# Altium schematic sheet Power.SchDoc
size A3
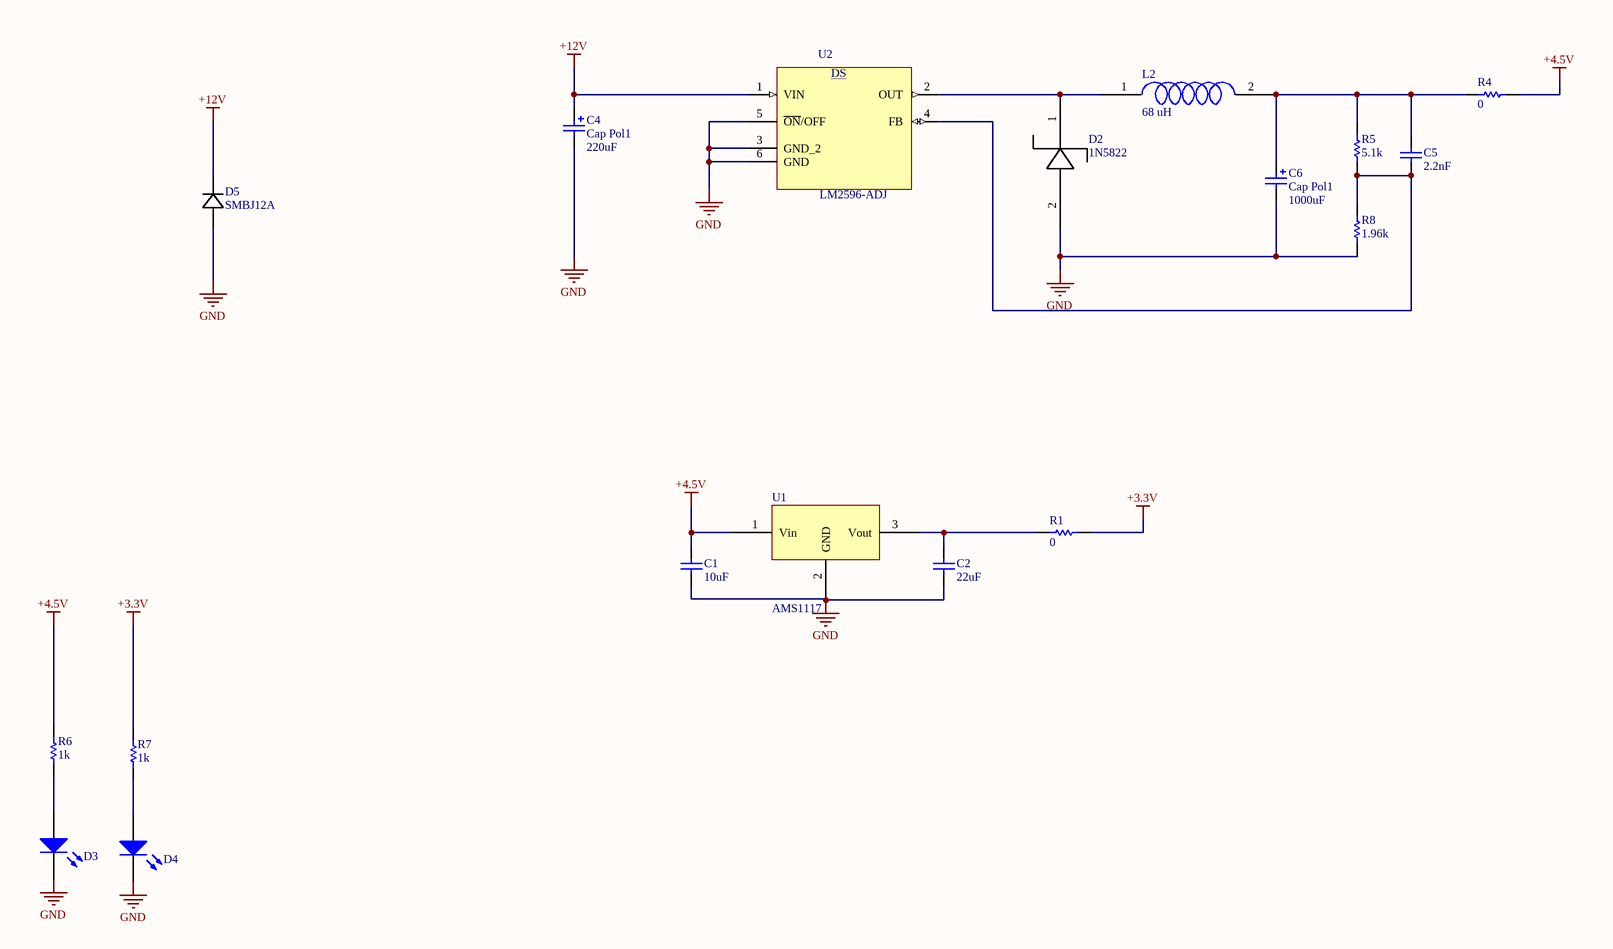
[diagram p0: Power.SchDoc]

## Parts
C1  value 10uF  [C-1206]  (hidden comment: C-1206)
C2  value 22uF  [C-1206]  (hidden comment: C-1206)
C4  Cap Pol1  value 220uF  [RB5-10.5]
C5  value 2.2nF  [C-805]  (hidden comment: C-805)
C6  Cap Pol1  value 1000uF  [RB5-10.5]
D2  1N5822  [1N5822]
D3  LED-805  [LED-805]  (value not drawn)
D4  LED-805  [LED-805]  (value not drawn)
D5  SMBJ12A  [SMB]
L2  68 uH  [Inductor]
R1  value 0  [R-1206]  (hidden comment: R-1206)
R4  value 0  [R-1206]  (hidden comment: R-1206)
R5  value 5.1k  [R-805]  (hidden comment: R-805)
R6  value 1k  [R-805]  (hidden comment: R-805)
R7  value 1k  [R-805]  (hidden comment: R-805)
R8  value 1.96k  [R-805]  (hidden comment: R-805)
U1  AMS1117  [AMS1117]
U2  LM2596-ADJ  [LM2596SX]

## Nets
+3.3V: R1.2 R7.2
+4.5V: C1.2 R4.2 R6.2 U1.1(Vin)
+12V: C4.1 D5.1 U2.1(VIN)
GND: C1.1 C2.1 C4.2 C6.2 D2.2 D3.2(K) D4.2(K) D5.2 R8.2 U1.2(GND) U2.3(GND_2) U2.5(~{ON}/OFF) U2.6(GND)
NetC2_2: C2.2 R1.1 U1.3(Vout)
NetC5_1: C5.1 R5.2 R8.1 U2.4(FB)
NetC5_2: C5.2 C6.1 L2.2 R4.1 R5.1
NetD2_1: D2.1 L2.1 U2.2(OUT)
NetD3_1: D3.1(A) R6.1
NetD4_1: D4.1(A) R7.1

## Notes on the sheet
- (in symbol LM2596-ADJ) DS

## Library data of the parts
C1 C2 = C-1206: Capacitor; Published: 8-Jun-2000; LatestRevisionDate: 29-May-2009; LatestRevisionNote: IPC-7351 Footprint Added.; PackageReference: C1206; Publisher: Altium Limited; PackageDescription: Chip Capacitor
C4 C6 = Cap Pol1: Polarized Capacitor (Radial); Published: 8-Jun-2000; LatestRevisionDate: 17-Jul-2002; LatestRevisionNote: Re-released for DXP Platform.; PackageReference: RB7.6-15; Publisher: Altium Limited; PackageDescription: Polarized Capacitor (Radial); 2 Leads
C5 = C-805: Capacitor; Published: 8-Jun-2000; LatestRevisionDate: 29-May-2009; LatestRevisionNote: IPC-7351 Footprint Added.; PackageReference: C1206; Publisher: Altium Limited; PackageDescription: Chip Capacitor
D3 D4 = LED-805: LED Size 805; Published: 8-Jun-2000; LatestRevisionDate: 17-Jul-2002; LatestRevisionNote: Re-released for DXP Platform.; PackageVersion: Feb-2002; PackageReference: 3.2X1.6X1.1; Publisher: Altium Limited; PackageDescription: SM LED; 2 Flat Leads
D5 = SMBJ12A: No Description Available; Manufacturer_Part_Number: SMBJ12A-13-F; Vendor: Diodes Inc; Built_By: EMA_UL_Team; Type: DEV; Copyright: Copyright (C) 2018 Accelerated Designs. All rights reserved; RefDes: RefDes; Value: Value
L2 = Inductor: Power inductor
R1 R4 = R-1206: Resistor
R5-R8 = R-805: Resistor
U1 = AMS1117: 3.3v regulator
U2 = LM2596-ADJ: SIMPLE SWITCHER Power Converter 150 KHz 3A Step-Down Voltage Regulator 5-DDPAK/TO-263; MF: Texas Instruments; MP: LM2596-ADJ; Package: TO-263-6 Texas Instruments; SnapEDA_Link: https://www.snapeda.com/parts/LM2596SX-12/Texas%20Instruments/view-part/?ref=snap; Price: 1.83 USD; Availability: Unavailable; Value: *